# Altium project Coin_Cell_Boost.PrjPCB
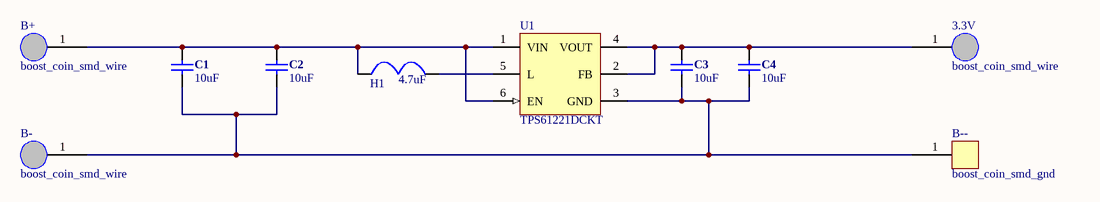
[diagram p0: Coin_Cell_Boost.SchDoc]
1 sheet, 10 parts. Net scope: global (net labels, ports and power ports of the same name join across sheets).
Board file: coin_boost_cell.PcbDoc

## Sheet Coin_Cell_Boost.SchDoc
size A4

### Parts
3.3V  boost_coin_smd_wire  [smd_pin]
B+  boost_coin_smd_wire  [smd_pin]
B-  boost_coin_smd_wire  [smd_pin]
B--  boost_coin_smd_gnd  [smd_gnd]
C1  10uF  [CAP-0805(2012)-R]
C2  10uF  [CAP-0805(2012)-R]
C3  10uF  [CAP-0805(2012)-R]
C4  10uF  [CAP-0805(2012)-R]
H1  4.7uF  [H-0805(2012)-H]
U1  TPS61221DCKT  [DCK0006A_L]

### Nets
Net3.3V_1: 3.3V.1 C3.1 C4.1 U1.2(FB) U1.4(VOUT)
NetB+_1: B+.1 C1.1 C2.1 H1.1 U1.1(VIN) U1.6(EN)
NetB-_1: B-.1 B--.1 C1.2 C2.2 C3.2 C4.2 U1.3(GND)
NetH1_2: H1.2 U1.5(L)

### Library data of the parts
C1-C4 = C-0805(2012): ___ OHM ___ mW 0805(2012) SMD; Manufacturer: Murata Electronics North America; Manufacturer Part Number: GRM21BR60J106ME19L; Tolerance: ±20%; Voltage - Rated: 6.3V; Temperature Coefficient: X5R; Supplier 1: Digi-Key; Supplier Part Number 1: 490-1718-1-ND; RoHS: RoHS Compliant; Category: Capacitors; Stock 1: 56711; Pricing 1: 1=0.12, 10=0.088, 100=0.0416, 500=0.02916, 1000=0.02414 (USD); Packaging: Cut Tape (CT); Part Status: Active; Operating Temperature: -55°C ~ 85°C; Features: -; Ratings: -; Applications: General Purpose; Mounting Type: Surface Mount, MLCC; Package / Case: 0805 (2012 Metric); Size / Dimension: 0.079" L x 0.049" W (2.00mm x 1.25mm); Height - Seated (Max): -; Thickness (Max): 0.053" (1.35mm); Lead Spacing: -; Lead Style: -; ComponentLink1URL: http://search.murata.co.jp/Ceramy/image/img/A01X/G101/ENG/GRM21BR60J106ME19-01.pdf; ComponentLink1Description: http://search.murata.co.jp/Ceramy/image/img/A01X/G101/ENG/GRM21BR60J106ME19-01.pdf
H1 = H-0805(2012): Manufacturer: Murata Electronics North America; Manufacturer Part Number: LQM21PN4R7NGRD; Material - Core: Ferrite; Tolerance: ±30%; Shielding: Shielded; DC Resistance (DCR): 288 mOhm Max; Supplier 1: Digi-Key; Supplier Part Number 1: 490-7782-1-ND; RoHS: RoHS Compliant; Category: Inductors, Coils, Chokes; Stock 1: 39282; Pricing 1: 1=0.14, 10=0.123, 100=0.0821, 500=0.06842, 1000=0.05748 (USD); Packaging: Cut Tape (CT); Part Status: Active; Type: Multilayer; Q @ Freq: -; Ratings: -; Operating Temperature: -55°C ~ 125°C; Mounting Type: Surface Mount; Package / Case: 0805 (2012 Metric); Supplier Device Package: 0805 (2012 Metric); Size / Dimension: 0.079" L x 0.050" W (2.00mm x 1.25mm); Height - Seated (Max): 0.039" (1.00mm); ComponentLink1URL: http://search.murata.co.jp/Ceramy/image/img/P02/JELF243B-0026.pdf; ComponentLink1Description: http://search.murata.co.jp/Ceramy/image/img/P02/JELF243B-0026.pdf
U1 = CMP-0343-00080-2: Boost Voltage Converter with 0.7 to 5.5 V Input and 3.3 V Output, -40 to 85 degC, 6-Pin SC70 (DCK), Green (RoHS & no Sb/Br); Manufacturer: Texas Instruments; Regulated Outputs(#): 1; Vout(Min)(V): 3.3; Vin(Max)(V): 5.5; Vin(Min)(V): 0.7; SubFamily: Step-Up Regulator; Switching Frequency(Max)(kHz): 2000; Topology: Boost; ComponentLink2URL: http://www.ti.com/litv/pdf/mpds114c; PackageReference: DCK0006A; PartNumber: TPS61221DCKT; ComponentLink2Description: Package Specification; Vout(Max)(V): 3.3; Eco-Plan: Green (RoHS & no Sb/Br); PackageDescription: 6-Pin Plastic Small-Outline Package, 2 x 1.3 mm Body, 0.65 mm Pitch, 2.1 mm Lead Span; Mounting Technology: Surface Mount; Code_JEDEC: MO-203-AB; DatasheetVersion: SLVS776; ComponentLink1URL: http://www.ti.com/general/docs/lit/getliterature.tsp?genericPartNumber=TPS61221&fileType=pdf; PackageVersion: revG, Jan-2007; ComponentLink1Description: Datasheet